# EAGLE design Thermorad-C (EAGLE 9.6.2)
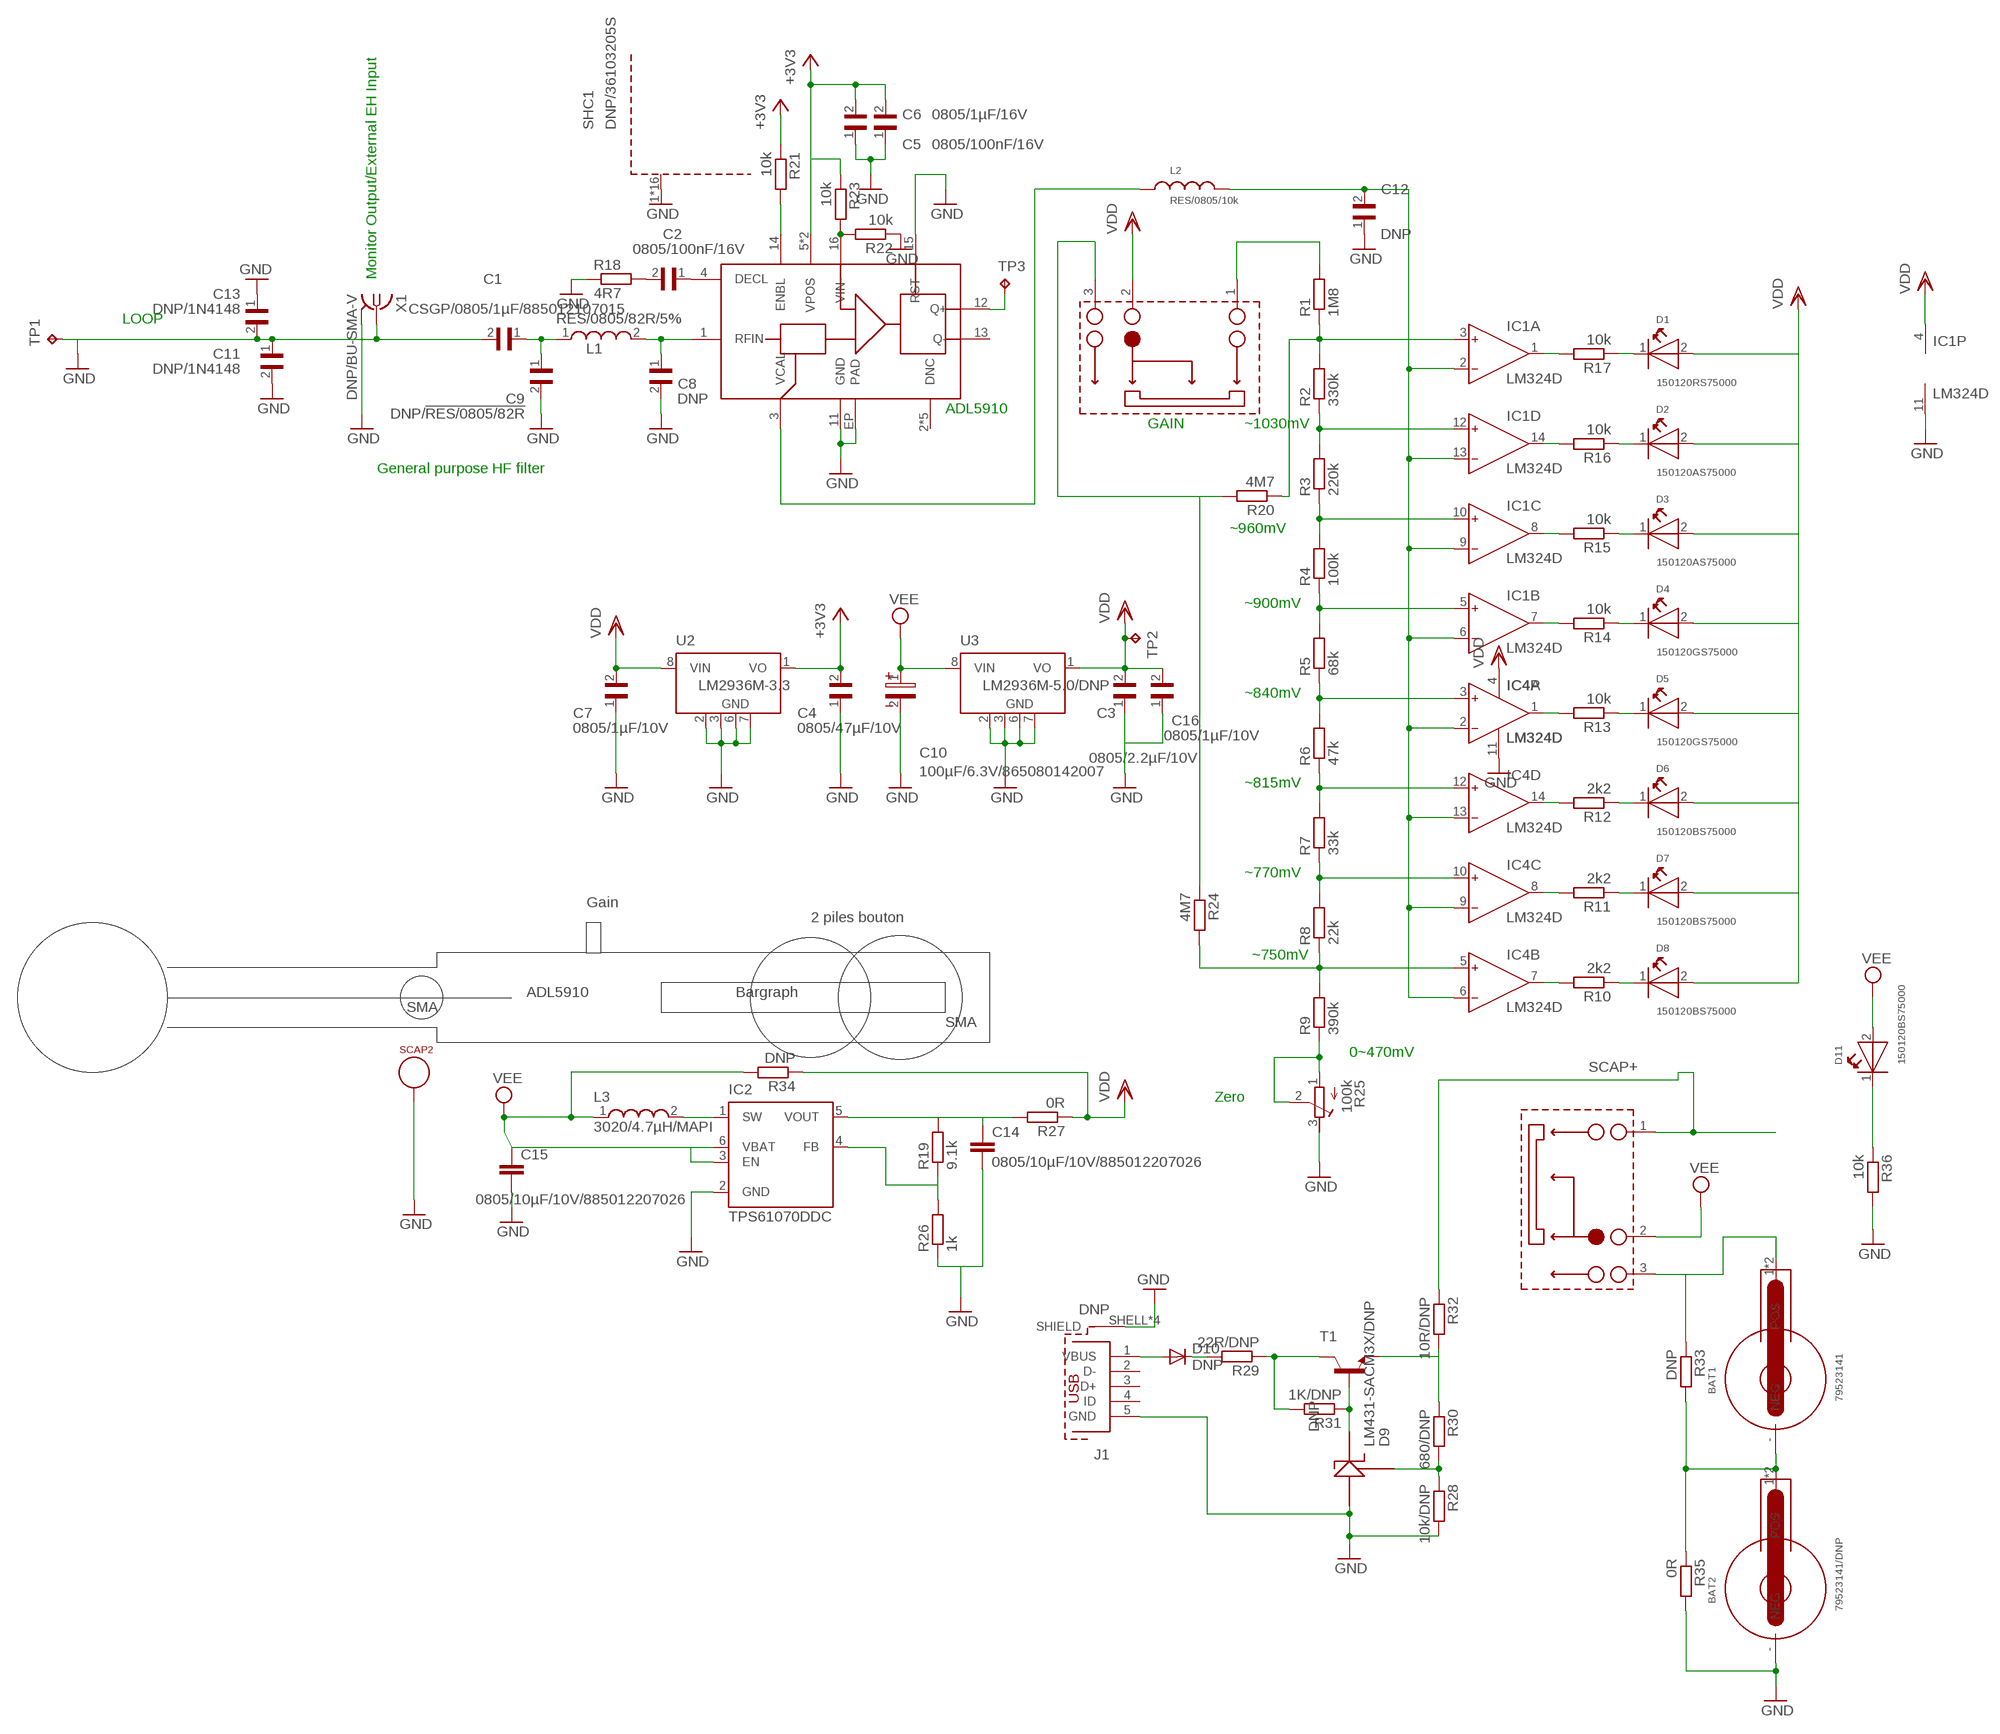
[diagram p0: schematic, sheet 1]

## Parts
BAT1  79523141  WA-BCMC_SMT_79523141  [79523141]
BAT2  79523141/DNP  WA-BCMC_SMT_79523141  [79523141]
C1  CSGP/0805/1µF/885012107015  WCAP-CSGP_0805-REFLOW  [WCAP-CSGP_0805_REFLOW]
C2  0805/100nF/16V  WCAP-CSGP_0805-REFLOW  [WCAP-CSGP_0805_REFLOW]
C3  0805/2.2µF/10V  WCAP-CSGP_0805-REFLOW  [WCAP-CSGP_0805_REFLOW]
C4  0805/47µF/10V  WCAP-CSGP_0805-REFLOW  [WCAP-CSGP_0805_REFLOW]
C5  0805/100nF/16V  WCAP-CSGP_0805-REFLOW  [WCAP-CSGP_0805_REFLOW]
C6  0805/1µF/16V  WCAP-CSGP_0805-REFLOW  [WCAP-CSGP_0805_REFLOW]
C7  0805/1µF/10V  WCAP-CSGP_0805-REFLOW  [WCAP-CSGP_0805_REFLOW]
C8  DNP  WCAP-CSGP_0805-REFLOW  [WCAP-CSGP_0805_REFLOW]
C9  DNP/!RES/0805/82R  WCAP-CSGP_0805-REFLOW  [WCAP-CSGP_0805_REFLOW]
C10  100µF/6.3V/865080142007  WCAP-ASLI_5X5.5(DXL)  [3X1.6X1.4(BXCXA)]
C11  DNP/1N4148  WCAP-CSGP_0805-REFLOW  [WCAP-CSGP_0805_REFLOW]
C12  DNP  WCAP-CSGP_0805-REFLOW  [WCAP-CSGP_0805_REFLOW]
C13  DNP/1N4148  WCAP-CSGP_0805-REFLOW  [WCAP-CSGP_0805_REFLOW]
C14  0805/10µF/10V/885012207026  C-EUC0805  [C0805]
C15  0805/10µF/10V/885012207026  C-EUC0805  [C0805]
C16  0805/1µF/10V  WCAP-CSGP_0805-REFLOW  [WCAP-CSGP_0805_REFLOW]
D1  150120RS75000  WL-SMCW-150120GS75000-G  [1206]
D2  150120AS75000  WL-SMCW-150120GS75000-G  [1206]
D3  150120AS75000  WL-SMCW-150120GS75000-G  [1206]
D4  150120GS75000  WL-SMCW-150120GS75000-G  [1206]
D5  150120GS75000  WL-SMCW-150120GS75000-G  [1206]
D6  150120BS75000  WL-SMCW-150120GS75000-G  [1206]
D7  150120BS75000  WL-SMCW-150120GS75000-G  [1206]
D8  150120BS75000  WL-SMCW-150120GS75000-G  [1206]
D9  LM431-SACM3X/DNP  LM431-SACM3X  [SOT23]
D10  DNP  DIODE-SOD123  [SOD123]
D11  150120BS75000  WL-SMCW-150120GS75000-G  [1206]
IC1  LM324D  AD8644R  [SO14]
IC2  TPS61070DDC  [TSOT23-6_DDC]
IC4  LM324D  AD8644R  [SO14]
J1  DNP  629105150521  [629105150521]
L1  RES/0805/82R/5%  WE-KI_0805A  [WE-KI_0805A]
L2  RES/0805/10k  WE-CBF_0805_74279209_WB_HS  [WE-CBF_0805(W=3.0)]
L3  3020/4.7µH/MAPI  WE-MAPI_3015/3020  [WE-MAPI_3015/3020]
R1  1M8  R-EU_M0805  [M0805]
R2  330k  R-EU_M0805  [M0805]
R3  220k  R-EU_M0805  [M0805]
R4  100k  R-EU_M0805  [M0805]
R5  68k  R-EU_M0805  [M0805]
R6  47k  R-EU_M0805  [M0805]
R7  33k  R-EU_M0805  [M0805]
R8  22k  R-EU_M0805  [M0805]
R9  390k  R-EU_M0805  [M0805]
R10  2k2  R-EU_M0805  [M0805]
R11  2k2  R-EU_M0805  [M0805]
R12  2k2  R-EU_M0805  [M0805]
R13  10k  R-EU_M0805  [M0805]
R14  10k  R-EU_M0805  [M0805]
R15  10k  R-EU_M0805  [M0805]
R16  10k  R-EU_M0805  [M0805]
R17  10k  R-EU_M0805  [M0805]
R18  4R7  R-EU_M0805  [M0805]
R19  9.1k  R-EU_R0805  [R0805]
R20  4M7  R-EU_M0805  [M0805]
R21  10k  R-EU_M0805  [M0805]
R22  10k  R-EU_M0805  [M0805]
R23  10k  R-EU_M0805  [M0805]
R24  4M7  R-EU_M0805  [M0805]
R25  100k  R-TRIMM3224X  [RTRIM3224X]
R26  1k  R-EU_R0805  [R0805]
R27  0R  R-EU_R0805  [R0805]
R28  10k/DNP  R-EU_R0805  [R0805]
R29  22R/DNP  R-EU_R0805  [R0805]
R30  680/DNP  R-EU_R0805  [R0805]
R31  1K/DNP  R-EU_R0805  [R0805]
R32  10R/DNP  R-EU_R0805  [R0805]
R33  DNP  R-EU_R0805  [R0805]
R34  DNP  R-EU_R0805  [R0805]
R35  0R  R-EU_R0805  [R0805]
R36  10k  R-EU_M0805  [M0805]
SCAP2  TESTPOINT-GROS  [TESTPOINT-GROS]
SHC1  DNP/36103205S  WE-SHC_36103205S  [WE-SHC_36103205S]
SW1  450404015514  [450404015514]
SW2  450404015514  [450404015514]
T1  DNP  BF622-NPN-SOT89-BCE  [SOT89-BCE]
TP1  TPB2,54  [B2,54]
TP2  TPB2,54  [B2,54]
TP3  TPB1,27  [B1,27]
U1  ADL5910  [LFCSP-16]
U2  LM2936M-3.3  [SO08]
U3  LM2936M-5.0/DNP  LM2936M-5.0  [SO08]
X1  DNP/BU-SMA-V  BU-SMA-V  [BU-SMA-V]

## Nets
+3V3: C4.2 C5.2 C6.2 R21.1 R23.1 U1.5(VPOS) U1.7(VPOS) U2.1(VO)
GND: BAT2.-(NEG) C1.2 C3.1 C4.1 C5.1 C6.1 C7.1 C8.2 C9.2 C10.2 C11.1 C11.2 C12.1 C13.1 C13.2 C14.2 C15.2 C16.1 D9.3(A) IC1.11(P:V-) IC2.2(GND) IC4.11(P:V-) J1.5(GND) J1.SHELL1(SHIELD) J1.SHELL2(SHIELD) J1.SHELL3(SHIELD) J1.SHELL(SHIELD) R18.1 R22.1 R25.3(A) R26.1 R28.2 R35.2 R36.2 SCAP2.1 SHC1.1(GND) SHC1.2(GND) SHC1.3(GND) SHC1.4(GND) SHC1.5(GND) SHC1.6(GND) SHC1.7(GND) SHC1.8(GND) SHC1.9(GND) SHC1.10(GND) SHC1.11(GND) SHC1.12(GND) SHC1.13(GND) SHC1.14(GND) SHC1.15(GND) SHC1.16(GND) TP1.TP U1.11(GND) U1.15(RST) U1.EP(PAD) U2.2(GND) U2.3(GND) U2.6(GND) U2.7(GND) U3.2(GND) U3.3(GND) U3.6(GND) U3.7(GND) X1.1 X1.2(GND)
N$1: IC2.1(SW) L3.2
N$2: IC4.10(C:IN+) R7.1 R8.2
N$3: IC4.12(D:IN+) R6.1 R7.2
N$4: IC4.3(A:IN+) R5.1 R6.2
N$5: IC1.5(B:IN+) R4.1 R5.2
N$6: IC1.10(C:IN+) R3.1 R4.2
N$7: IC1.12(D:IN+) R2.1 R3.2
N$8: IC1.3(A:IN+) R1.1 R2.2 R20.1
N$9: C1.1 C9.1 L1.1
N$10: IC4.14(D:OUT) R12.2
N$11: C8.1 L1.2 U1.1(RFIN)
N$12: IC1.1(A:OUT) R17.2
N$13: D1.1(K) R17.1
N$14: IC1.14(D:OUT) R16.2
N$15: D6.1(K) R12.1
N$16: IC4.8(C:OUT) R11.2
N$17: D7.1(K) R11.1
N$18: D2.1(K) R16.1
N$19: IC1.8(C:OUT) R15.2
N$21: IC4.7(B:OUT) R10.2
N$22: D8.1(K) R10.1
N$23: D3.1(K) R15.1
N$24: IC1.7(B:OUT) R14.2
N$25: D4.1(K) R14.1
N$26: IC4.1(A:OUT) R13.2
N$27: D5.1(K) R13.1
N$28: BAT1.1(POS) BAT1.2(POS) R33.1 SW2.3
N$29: BAT1.-(NEG) BAT2.1(POS) BAT2.2(POS) R33.2 R35.1
N$30: R1.2 SW1.1
N$31: C2.1 U1.4(DECL)
N$32: C2.2 R18.2
N$33: C12.2 IC1.2(A:IN-) IC1.6(B:IN-) IC1.9(C:IN-) IC1.13(D:IN-) IC4.2(A:IN-) IC4.6(B:IN-) IC4.9(C:IN-) IC4.13(D:IN-) L2.2
N$34: R9.1 R25.1(E) R25.2(S)
N$35: L2.1 U1.3(VCAL)
N$36: R21.2 U1.14(ENBL)
N$37: R20.2 R24.1 SW1.3
N$38: R22.2 R23.2 U1.16(VIN-)
N$39: R30.1 R32.2 T1.E
N$40: TP3.TP U1.12(Q+)
N$41: IC4.5(B:IN+) R8.1 R9.2 R24.2
N$42: IC2.4(FB) R19.1 R26.2
N$43: C14.1 IC2.5(VOUT) R19.2 R27.2
N$44: D11.1(K) R36.1
N$45: D10.A J1.1(VBUS)
N$46: D10.C R29.2
N$47: R29.1 R31.2 T1.C
N$48: D9.1(K) R31.1 T1.B
N$50: D9.2(REF) R28.1 R30.2
SCAP+: R32.1 SW2.1
VDD: C3.2 C7.2 C16.2 D1.2(A) D2.2(A) D3.2(A) D4.2(A) D5.2(A) D6.2(A) D7.2(A) D8.2(A) IC1.4(P:V+) IC4.4(P:V+) R27.1 R34.1 SW1.2 TP2.TP U2.8(VIN) U3.1(VO)
VEE: C10.1 C15.1 D11.2(A) IC2.3(EN) IC2.6(VBAT) L3.1 R34.2 SW2.2 U3.8(VIN)
Unconnected: J1.2(D-) J1.3(D+) J1.4(ID) U1.2(DNC) U1.6(DNC) U1.8(DNC) U1.9(DNC) U1.10(DNC) U1.13(Q-)

## Notes on the sheet
- Monitor Output/External EH Input
- LOOP
- ADL5910
- GAIN | ~1030mV
- General purpose HF filter
- ~960mV
- ~900mV
- ~840mV
- ~815mV
- ~770mV
- Gain
- 2 piles bouton
- ~750mV
- ADL5910 | Bargraph
- SMA
- SMA
- 0~470mV
- Zero

## Power pins joined to a net without a drawn wire
GND: X1.3(GND) X1.4(GND) X1.5(GND)

## Library data of the parts
BAT1 BAT2 = EAGLE-BATTERY_HOLDERS:WA-BCMC: Battery Holder WA-BCMC Characteristics Material : Phosphor Bronze Surface:Nichel Comliance:Lead free and RoHs Packaging unit is 500 <http://katalog.we-online.de/media/images/v2/Family_WA-BCMC_Battery_Holder_795xxxxx.jpg> Details see: http://katalog.we-online.de/en/em/BCMC_BATTERY_HOLDER/79523141 2015 (C) Wurth Elektronik
C1-C9 C11-C13 C16 = Eagle_Wurth_Elektronik_Passive_Capacitors_rev15a:WCAP-CSGP: WCAP-CSGP Ceramic Capacitors Characteristics Multilayer Ceramic Chip Capacitor Recommended soldering:Reflow, for 0603 and 0805 wave soldering is also allowed Operating temperature:-55 °C to +125 °C; Ceramic characteristics: Class I - NPO ; Class II -X7R, X5R High performance ceramic High capacitance stability Minimal aging Termination:Cu/Ni/Sn <http://katalog.we-online.de/media/images/eisos/WCAP-CSGP_pf2.jpg> Details see: http://katalog.we-online.de/en/pbs/WCAP-CSGP/?m Created: 2015-01-28 2015 (C) Wurth Elektronik
C10 = Eagle_Wurth_Elektronik_Passive_Capacitors_rev15a:WCAP-ASLI: WCAP-ASLI Aluminum Electrolytic Capacitors Characteristics Aluminum Electrolytic Capacitor Recommended soldering: Reflow Operating temperature: -55 °C to +105 °C Low impedance product series Load life:2000 h @ +105 °C Package name and Variant abbreviation: Package: Package: B X C X A = length of the solder pad X width of the solder pad X pitch of the solder pad. Variant: D X L = Diameter of the body part X Height of the body part. <http://katalog.we-online.de/media/images/eisos/WCAP-ASLI_pf2.jpg> Details see: http://katalog.we-online.de/en/pbs/WCAP-ASLI?m Created: 2015-03-10 2015 (C) Wurth Elektronik
C14 C15 = resistor:C-EU: CAPACITOR, European symbol
D1-D8 D11 = Wurth_Elektronik_Optoelectronics_rev15b:WL-SMCW: SMD mono-color Chip LED Characteristics Low energy consumption High reliability Low current requirement Fast switching No UV/IR radiation Smallest SMD package with exceptional brightness Top view Wide viewing angle PBC high-usage Applications Backlight for mobile and portable device keypads Indoor and outdoor message boards Flat backlight for LCDs, switches and symbols Display for industrial control systems and traffic Miniaturized color effects Pedestrian mark Optical indicators General lighting Toys <http://katalog.we-online.de/media/images/eipal/WL-SMCW_pf2.jpg> Details see: http://katalog.we-online.de/en/led/WL-SMCW?m Updated 2015-04-10 2015 (C) Wurth Elektronik; COMPANY-URL: http://www.we-online.de; CREATED-BY: Christin Otto; CREATED-DATE: APR 2013; DATASHEET-URL: http://katalog.we-online.de/en/led/WL-SMCW?m=t&sq=smcw&sp=&sp=http%3A%2F%2Fwww.we-online.de%2Fweb%2Fen%2Felectronic_components%2Fsearchpage_PBS.php%3Fsearch%3Dsmcw#vs_t2:2; MANUFACTURER: Würth Elektronik eiSos GmbH
D9 = Ebenoid-Actifs:LM431-SACM3X
D10 = diode:DIODE-: DIODE
IC1 IC4 = analog-devices:AD8644: Single and Quad 18 V Operational Amplifiers Source: http://www.analog.com/static/imported-files/data_sheets/AD8614_8644.pdf; MF: ALTERA CORPORATION; MPN: AD8644ARZ; OC_FARNELL: 1438873; OC_NEWARK: 59K7037
IC2 = texas:TPS6107*: 90% EFFICIENT SYNCHRONOUS BOOST CONVERTER WITH 600-mA SWITCH Source: http://focus.ti.com/lit/ds/symlink/tps61070.pdf; MPN: TPS61070DDCR; OC_FARNELL: 1461062; OC_NEWARK: 64M3125
J1 = InputOutputIO (rev18a):629105150521: WR-COM_USB_Micro Type B_Horizontal_SMT ; Micro Type B Horizontal SMT - 3A current at Pin1 & Pin 5 - with Pegs and THT shielding Pins - T&R Packaging Code : Con_I-O_COM_USB_2.0_B_629105150521_629105150521 <http://katalog.we-online.de/media/images/eican/Con_I-O_COM_USB_2.0_B_629105150521_pf2.jpg> Details see: http://katalog.we-online.de/em/datasheet/629105150521.pdf Created 12/08/2014, Dan Xu 2014 (C) Wurth Elektronik
L1 = EAGLE-EMC_COMPONENTS-rev17a:WE-KI: SMD Wire Wound Ceramic Inductor Characteristics WE-KI series offers you an excellent Q factor and highest possible self resonant frequencies up to 12.5 GHz Inductance tolerances: 5% (2% on request) High thermal stability Operating temperature: –40°C to +125°C Applications Especially developed for high frequency applications RF transceiver/communications Bluetooth Wireless LAN <http://katalog.we-online.de/media/images/v2/Family_WE-KI.jpg> Details see: http://katalog.we-online.de/en/pbs/WE-KI Updated by Dan Xu 2014-07-08 2014 (C) Wurth Elektronik
L2 = EMCComponents (rev19a):WE-CBF_0805: WE-CBF SMD EMI Suppression Ferrite Bead Characteristics Reliable Ni-Sn electrodes High rated current up to 6 A Operating temperature: –55 ºC to +125 ºC Applications Perfect as data lined filter and for uncoupling of distribution voltage Variant abbreviation WB means WIDE BAND HS means HIGH SPEED HC means HIGH CURRENT <http://katalog.we-online.de/media/images/v2/Family_WE-CBF.jpg> Details see: http://katalog.we-online.de/en/pbs/WE-CBF Updated on 2014-06-19 2014 (C) Wurth Elektronik; WE-NUMBER: 74279209/1200Ω(Z@100MHz)
L3 = Wurth_Elektronik_Passive_rev15b:WE-MAPI: SMD Metal Alloy Power Inductor Characteristics Magnetic iron alloy allows high rated currents Compact design Magnetically shielded High current capability and handles high transient current spikes Low acoustic noise and low leakage flux noise Operating temperature: –40 °C to 125 °C Applications DC/DC-converter for high current power supplies DC/DC-converter for Field Programmable Gate Array (FPGA) POL-converters Portable power like PDA, digital camera Mainboards/graphic cards Battery powered devices Wireless communication devices Power supplies for smartphones, tablet PCs and other mobile devices <http://katalog.we-online.de/media/images/eisos/IndMAPI_pf2.jpg> Details see: http://katalog.we-online.de/en/pbs/WE-MAPI? Updated by Dan Xu 2014-07-08 2014 (C) Wurth Elektronik
R1-R24 R26-R36 = resistor:R-EU_: RESISTOR, European symbol
R25 = resistor:R-TRIMM: Trimm resistor
SCAP2 = Ebenoid-Divers:TESTPOINT-GROS
SHC1 = EMCComponents (rev19a):WE-SHC: Shielding Cabinet Characteristics Tin plate in accordance with DIN EN 10202/10203 Shielding effectiveness up to 55 dB Two-part case consisting of a solderable grid frame (SMD/THT) and a removable cover Applications To prevent EMI radiation from PCB and to keep sensitivity low of: - RF output stages - RF input and amplifier stages; - Oscillators - EMC sensitive parts in plastic cases <http://katalog.we-online.de/media/images/v2/Family_WE-SHC_NEU_2017.jpg> Details see: http://katalog.we-online.de/en/pbs/WE-SHC?m Updated by Dan Xu 2014-07-11 2014 (C) Wurth Elektronik
SW1 SW2 = EAGLE-450404015514-rev1:450404015514: WS-SLSU Right angle Slide Switch with boss design Specification Rating 300mA, 12VDC Contact Resistance Initial:70mΩ max. After life test: 200mΩ max. Insulation Resistance: min.100MΩ at 500VDC Dielectric Strength : 250VAC for 1 minute Travel:1.5±0.15mm Operating force :150 ± 75g. Life cycle:10000 steps Switch function : ON-ON. Material Cover : : Stainless Steel Base :PA46 UL 94 HB,COLOR Black Frame :LCP UL 94 V-0, color Black Contact : :Copper Alloy with Silver Terminal : Copper Alloy with Silver 2015 (C) Wurth Elektronik
T1 = transistor-neu-to92:*-NPN-: NPN Transistror
TP1-TP3 = testpad:TP: Test pad
U1 = LT:ADL5910
U2 = national-semiconductor:LM2936M?*: Ultra-Low Quiescent Current LDO Voltage Regulator Source: Data sheet <http://www.national.com/ds/LM/LM2936.pdf>; MF: NATIONAL SEMICONDUCTOR; MPN: LM2936M-3.3/NOPB; OC_FARNELL: 1469059; OC_NEWARK: 41K4514
U3 = national-semiconductor:LM2936M?*: Ultra-Low Quiescent Current LDO Voltage Regulator Source: Data sheet <http://www.national.com/ds/LM/LM2936.pdf>; MF: NATIONAL SEMICONDUCTOR; MPN: LM2936M-5.0/NOPB; OC_FARNELL: 9494421; OC_NEWARK: 41K4515
X1 = con-coax:BU-SMA-V: FEMALE SMA CONNECTOR Radiall distributor RS 112-3794; OC_FARNELL: unknown; OC_NEWARK: unknown

## Board
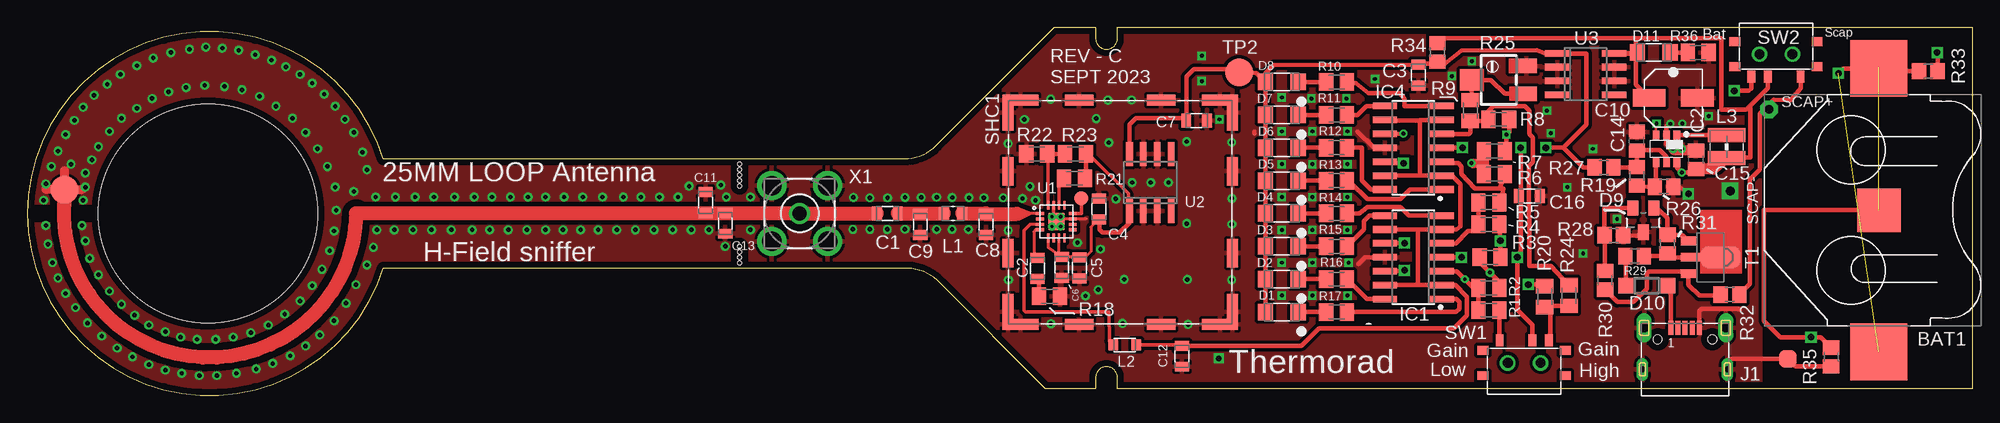
[diagram p1: board, top side]
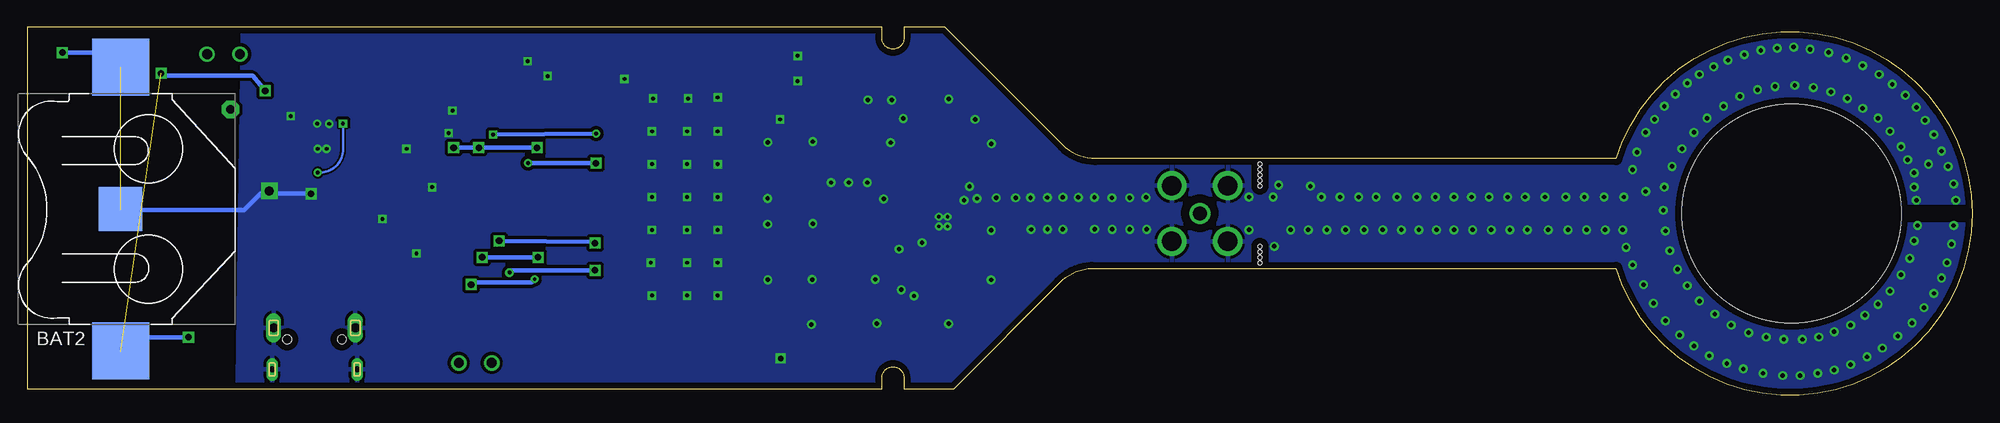
[diagram p2: board, bottom side, seen from below]

Size 177.49 x 33.61 mm. Coordinates in mm from the lower left corner, seen from the top.
Outline: 32.49,21.61 arc325 32.49,11.61 80.34,11.61 arc-45 83.28,10.27 92.94,0.61 97.49,0.61 97.49,1.61 arc-180 99.49,1.61 99.49,0.61 177.49,0.61 177.49,33.61 99.49,33.61 99.49,32.61 arc-180 97.49,32.61 97.49,33.61 93.74,33.61 82.95,22.82 arc-45 80.02,21.61 32.49,21.61
Copper layers (1*16): Top 0.035mm / dielectric 1.5mm / Bottom 0.035mm
Design rules "default *": minimum track width 0.2mm, minimum drill 0.3mm, track to track 0.15mm, track to pad 0.15mm, pad to pad 0.15mm, via to via 0.15mm, smd to smd 0.15mm, copper to edge 0.6mm, drill to drill 8mil, minimum pad ring 10mil, minimum via ring 8mil, stop-mask expansion 4mil, vias tented up to drill 0mil, thermal gap 10mil
Holes 20 mm at 16.49,16.61
Holes 0.35 mm at 64.99,12.11 64.99,12.61 64.99,13.11 64.99,13.61 64.99,19.11 64.99,19.61 64.99,20.11 64.99,20.61 64.99,21.11
tRestrict: area 69.3,15.4 to 71.7,17.8; 11 lines
bRestrict: area 69.3,15.4 to 71.7,17.8; 1 lines

### Footprints (pad centres in the part's own frame; a part is rotated, then mirrored left to right if it is on the bottom)
79523141 = smd 5.2 x 5.2: 1 -12.95,0; 2 12.95,0 | smd 4 x 4: - 0,0
WCAP-CSGP_0805_REFLOW = smd 0.9 x 1.3: 1 -0.95,0; 2 0.95,0
3X1.6X1.4(BXCXA) = smd 3 x 1.6: 1 2.2,0; 2 -2.2,0
C0805 = smd 1.3 x 1.5: 1 -0.85,0; 2 0.85,0
1206 = smd 1.4 x 1.5: 1 -1.5,0; 2 1.5,0
SOT23 = smd 1 x 1.4: 1 -0.95,-1.1; 2 0.95,-1.1; 3 0,1.1
SOD123 = smd 1.4 x 1.4: A 1.9,0; C -1.9,0
SO14 = smd 0.6 x 2.2: 1 -3.81,-2.6; 2 -2.54,-2.6; 3 -1.27,-2.6; 4 0,-2.6; 5 1.27,-2.6; 6 2.54,-2.6; 7 3.81,-2.6; 8 3.81,2.6; 9 2.54,2.6; 10 1.27,2.6; 11 0,2.6; 12 -1.27,2.6; 13 -2.54,2.6; 14 -3.81,2.6
TSOT23-6_DDC = smd 0.6 x 0.8: 1 -0.95,-1.25; 2 0,-1.25; 3 0.95,-1.25; 4 0.95,1.25; 5 0,1.25; 6 -0.95,1.25
629105150521 = smd 0.45 x 1.3: 1 -1.3,1.05; 2 -0.65,1.05; 3 0,1.05; 4 0.65,1.05; 5 1.3,1.05 | drill 0.85 pad 1.2 long: SHELL -3.725,1.05; SHELL1 3.725,1.05 | drill 0.55 pad 0.9 long: SHELL2 -3.875,-2.75; SHELL3 3.875,-2.75 | hole 0.8: -2.5,0; 2.5,0
WE-KI_0805A = smd 0.925 x 1.2: 1 -0.838,0; 2 0.838,0
WE-CBF_0805(W=3.0) = smd 0.9 x 1: 1 -1.05,0; 2 1.05,0
WE-MAPI_3015/3020 = smd 1.3 x 3.4: 1 -1.05,0; 2 1.05,0
M0805 = smd 1.3 x 1.6: 1 -0.95,0; 2 0.95,0
R0805 = smd 1.3 x 1.5: 1 -0.85,0; 2 0.85,0
RTRIM3224X = smd 1.32 x 1.9: 1 -1.27,-2.54; 3 1.27,-2.54 | smd 2 x 2: 2 0,2.54
TESTPOINT-GROS = smd 1.6 x 1.6: 1 0,0
WE-SHC_36103205S = smd 2.6 x 1: 1 -3.75,10.25; 2 3.75,10.25; 7 -3.75,-10.25; 8 3.75,-10.25 | smd 1 x 2.6: 3 -10.25,3.75; 4 -10.25,-3.75; 5 10.25,-3.75; 6 10.25,3.75 | smd 3.3 x 1: 9 -9.1,10.25; 11 9.1,10.25; 13 -9.1,-10.25; 15 9.1,-10.25 | smd 1 x 3.3: 10 -10.25,9.1; 12 10.25,9.1; 14 -10.25,-9.1; 16 10.25,-9.1
450404015514 = smd 0.7 x 1.1: 1 2.25,-2.05; 2 -0.75,-2.05; 3 -2.25,-2.05 | smd 1 x 0.8: Z1 -3.75,1.15; Z2 3.75,1.15; Z3 3.75,-1.15; Z4 -3.75,-1.15 | drill 0.9: Z5 -1.5,0; Z6 1.5,0
SOT89-BCE = smd 0.8 x 1.4: B -1.499,-1.981; E 1.499,-1.981 | smd 0.8 x 1.9: C 0,-1.727 | smd 2.032 x 3.65: C@1 0,0.94
B2,54 = smd 2.54 x 2.54: TP 0,0
B1,27 = smd 1.27 x 1.27: TP 0,0
LFCSP-16 = smd 0.8 x 0.305: 1 -1.5,0.75; 2 -1.5,0.25; 3 -1.5,-0.25; 4 -1.5,-0.75; 9 1.5,-0.75; 10 1.5,-0.25; 11 1.5,0.25; 12 1.5,0.75 | smd 0.305 x 0.8: 5 -0.75,-1.5; 6 -0.25,-1.5; 7 0.25,-1.5; 8 0.75,-1.5; 13 0.75,1.5; 14 0.25,1.5; 15 -0.25,1.5; 16 -0.75,1.5 | smd 1.5 x 1.6: EP 0,0
SO08 = smd 0.6 x 2.2: 1 -1.905,-2.6; 2 -0.635,-2.6; 3 0.635,-2.6; 4 1.905,-2.6; 5 1.905,2.6; 6 0.635,2.6; 7 -0.635,2.6; 8 -1.905,2.6
BU-SMA-V = drill 1.27: 1 0,0 | drill 1.778: 2 -2.55,2.55; 3 2.55,2.55; 4 2.55,-2.55; 5 -2.55,-2.55

### Placement (x,y rotation side)
BAT1  168.99,16.91 270 top
BAT2  168.99,17.01 90 bottom
C1  78.49,16.61 180 top
C2  92.2,11.58 270 top
C3  126.96,29.24 90 top
C4  97.8,17.02 270 top
C5  96.02,11.64 90 top
C6  94.4,11.68 90 top
C7  106.72,25.1 180 top
C8  87.49,15.61 270 top
C9  81.49,15.61 270 top
C10  150.21,27.16 180 top
C11  61.89,17.61 90 top
C12  105.37,3.57 90 top
C13  63.69,15.71 90 top
C14  146.89,23.21 90 top
C15  152.29,21.51 90 top
C16  137.09,18.21 180 top
D1  114.49,7.61 180 top
D2  114.49,10.61 180 top
D3  114.49,13.61 180 top
D4  114.49,16.61 180 top
D5  114.49,19.61 180 top
D6  114.49,22.61 180 top
D7  114.49,25.61 180 top
D8  114.49,28.61 180 top
D9  147.49,16.01 180 top
D10  147.79,10.01 0 top
D11  148.44,31.3 180 top
IC1  126.49,12.61 90 top
IC2  149.59,22.51 180 top
IC4  126.49,22.61 90 top
J1  151.29,5.11 0 top
L1  84.49,16.61 0 top
L2  100.15,4.59 0 top
L3  155.09,22.71 90 top
R1  133.39,7.78 0 top
R2  133.39,9.81 180 top
R3  133.49,12.61 180 top
R4  133.39,15.61 0 top
R5  133.39,17.61 180 top
R6  133.89,20.21 0 top
R7  133.89,22.31 180 top
R8  134.29,25.21 0 top
R9  131.69,26.01 270 top
R10  119.49,28.61 0 top
R11  119.49,25.61 0 top
R12  119.49,22.61 0 top
R13  119.49,19.61 0 top
R14  119.49,16.61 0 top
R15  119.49,13.61 0 top
R16  119.49,10.61 0 top
R17  119.49,7.61 0 top
R18  93.29,9.05 180 top
R19  146.89,20.01 90 top
R20  138.49,9.01 270 top
R21  95.57,19.82 180 top
R22  92.12,22.04 0 top
R23  95.66,22.04 180 top
R24  140.69,9.11 90 top
R25  134.29,28.81 90 top
R26  149.37,19.06 180 top
R27  143.89,20.81 0 top
R28  144.79,14.61 0 top
R29  146.69,12.71 180 top
R30  143.99,10.51 90 top
R31  149.69,13.81 270 top
R32  155.39,9.21 180 top
R33  173.49,29.61 0 top
R34  128.69,31.32 90 top
R35  164.63,3.5 270 top
R36  152.49,31.31 0 top
SCAP2  160.69,3.31 0 top
SHC1  99.73,16.73 270 top
SW1  136.61,2.96 180 top
SW2  159.59,31.16 0 top
T1  153.59,12.61 270 top
TP1  3.4,18.77 0 top
TP2  110.59,29.51 270 top
TP3  96.19,18.01 0 top
U1  93.91,15.86 0 top
U2  102.49,19.44 0 top
U3  142.22,29.34 270 top
X1  70.49,16.61 0 top

### Tracks (layer width: path | path; a pad name or v marks a point on that pad's centre or on a via)
+3V3
  Top 0.2: 96.86,22.04 R23.1 | 96.61,19.91 R21.1
  Top 0.254: U1.5 93.16,13.5 C6.2 94.14,12.65 94.31,12.62 | 94.31,12.62 arc-90 94.16,12.77 U1.7 | 94.31,12.62 95.26,12.62 arc-90 C5.2 95.36,12.62 96.56,12.62 97.06,13.12 97.06,15.37 97.81,16.12 97.84,16.15
  Top 0.305: U2.1 100.49,16.93 100.49,18.41 96.86,22.04
  Top 0.406: 97.81,16.12 C4.2 97.84,16.03 97.84,15.14 98.12,14.86 99.69,14.86 100.58,15.75 U2.1 | R23.1 96.61,19.91
GND  (via drill 0.3 pad 0.41, 0.35, 0.4 pad 0.41, 0.5, 0.6, 0.8 pad 1.5)
  Top 0.254: 94.16,16.11 U1.11 96.66,16.11 | 94.16,16.11 arc90 U1.EP | 94.16,16.11 94.16,16.16 v94.3,16.3
  Top 0.305: U1.15 93.66,16.3 v93.52,16.3 | C11.1 C13.2 63.74,16.66 63.79,16.61
  Top 0.406: X1.1 arc279 70.53,16.61 | 3.49,18.61 3.4,18.61 TP1.TP 3.4,18.8 3.39,18.81 | IC1.11 122.09,12.61 121.49,12.01 | IC4.11 122.89,22.61 121.39,24.11 | 111.99,24.11 111.99,23.91 | D9.3 146.84,14.56 R28.2 | 150.25,22.41 149.59,22.91 IC2.2 149.57,24.61 | 151.79,22.41 152.39,22.31 C15.2 | C14.2 146.89,24.61 | R26.1 150.79,19.01 v151.59,18.41 | J1.SHELL3 155.31,3.31 SCAP2.1 161.35,2.65 R35.2 | J1.5 152.59,7.71 152.79,7.91 156.19,7.91 156.29,7.81
  Top 0.8: 3.39,18.81 4.99,18.81 | 3.39,18.81 3.39,20.51 | 3.39,18.81 1.69,18.81
  Top 0.9: 150.25,22.41 151.79,22.41
  Top 1.27: 3.49,18.61 arc96 16.04,3.46 arc92 29.99,16.61 63.79,16.61 70.53,16.61 C1.2
  Bottom 0.406: 151.59,18.71 v151.59,18.41 156.19,18.41 157.69,16.91 168.89,16.91 BAT2.-
  other vias: 108.74,3.36 1.69,15.51 1.89,13.81 2.29,12.11 2.79,10.71 3.49,9.31 4.39,8.01 5.49,6.61 6.79,5.41 8.19,4.31 9.59,3.51 11.09,2.81 12.59,2.31 14.09,2.01 15.69,1.81 17.29,1.81 19.09,2.01 20.89,2.41 22.39,2.91 23.99,3.61 25.39,4.51 26.69,5.51 4.99,15.51 5.29,14.11 5.69,12.51 6.49,11.01 7.49,9.51 8.59,8.31 9.79,7.31 11.09,6.41 12.59,5.81 13.99,5.31 15.49,5.11 17.19,5.11 18.79,5.31 20.39,5.71 21.99,6.41 23.49,7.41 24.89,8.61 27.99,6.81 25.99,10.01 29.09,8.41 26.89,11.51 29.99,10.11 27.59,13.21 27.99,15.01 28.19,16.91 28.09,19.01 30.99,11.91 31.59,13.51 31.89,15.11 5.09,17.81 5.29,19.01 5.29,20.31 3.99,21.11 2.19,20.91 1.49,17.81 1.69,19.31 29.79,18.61 31.79,18.11 30.99,20.61 27.39,20.91 26.49,22.51 30.59,22.21 25.39,24.01 24.19,25.31 22.69,26.41 21.19,27.31 19.59,27.91 17.99,28.21 16.19,28.31 14.49,28.11 12.89,27.71 11.39,27.11 9.99,26.21 8.59,25.31 7.49,24.11 6.49,22.71 5.89,21.51 2.79,22.31 3.49,23.81 4.29,25.11 5.09,26.31 6.09,27.41 7.29,28.41 8.49,29.31 9.99,30.11 11.49,30.81 13.09,31.31 14.79,31.61 16.29,31.81 17.79,31.71 19.29,31.51 20.79,31.11 22.29,30.61 23.59,30.01 24.89,29.31 25.99,28.51 27.09,27.51 28.09,26.41 28.99,25.21 29.79,24.01 33.49,15.11 35.19,15.11 36.89,15.11 38.69,15.11 40.59,15.11 42.19,15.11 43.89,15.11 45.59,15.11 47.29,15.11 42.39,18.11 33.59,18.11 35.39,18.11 37.09,18.11 38.99,18.11 40.79,18.11 44.09,18.11 48.89,15.11 50.49,15.11 52.09,15.11 53.79,15.11 55.49,15.11 57.19,15.11 58.89,15.11 60.59,15.11 62.19,15.11 63.69,13.61 65.99,15.11 45.69,18.11 47.29,18.11 48.99,18.11 50.69,18.11 52.49,18.11 54.39,18.11 55.99,18.11 57.69,18.11 59.39,18.11 60.39,19.11 63.29,19.21 63.79,18.11 65.99,18.11 75.39,18.08 76.89,18.04 78.5,18.05 80.1,18.08 81.57,18.08 82.99,18.09 84.4,18.07 85.94,18.06 87.3,18.05 89.07,18.05 90.82,17.98 92.01,17.82 75.33,15.16 76.89,15.16 78.48,15.16 82.99,15.16 84.39,15.16 85.89,15.15 89.52,15.07 80.09,15.17 93.52,15.42 94.3,15.42 89.51,22.98 91,25.21 93.4,27.06 98.61,26.97 100.78,26.98 109.91,23.11 109.94,17.99 105.93,6.47 109.92,10.55 105.87,10.57 89.54,10.54 93.41,6.53 109.93,15.63 99.96,6.56 96.57,9.08 97.74,9.64 97.94,13.34 100.84,19.44 102.54,19.44 104.14,19.44 97.55,25.29 98.71,23.08 91.51,19.08 100.11,10.58 105.81,15.68 105.81,23.18 99.34,17.94 95.84,13.94 150.19,22.51 150.99,22.51 145.09,16.11 138.69,26.01 142.89,22.51 117.19,27.11 120.39,27.11 120.49,24.11 117.29,24.11 114.49,24.11 114.49,27.21 114.49,21.11 117.29,21.11 120.49,21.11 114.49,18.11 117.29,18.11 120.49,18.11 114.49,15.11 117.29,15.11 120.49,15.11 114.49,12.11 117.29,12.11 120.59,12.11 114.49,9.11 117.29,9.11 120.49,9.11 107.19,31.01 107.19,28.71 108.79,25.21 155.41,18.67 149.95,24.79 151.04,24.82 140.54,19.01 141.98,12.95 123,28.89 130,29.16 131.83,30.53 139.05,23.96 153.46,25.49
  pour Top (isolate 0.3, rank 6): 111.97,24.47 112.49,24.61 113.49,24.11 113.49,31.36 158.07,31.96 158.17,1.18 112.07,1.08
  pour Top (isolate 0.3): -0.51,36.61 -0.51,-0.39 127.62,1.4 127.64,36.61
  pour Bottom (isolate 0.3): -0.51,36.61 -0.51,-0.39 158.29,1.21 157.79,35.71 109.49,36.61
  pour Bottom: 148.09,24.81 151.69,24.81 151.69,18.11 148.09,18.11
N$1
  Top 0.406: L3.2 IC2.1
N$2  (via drill 0.35)
  Top 0.406: IC4.10 v125.59,23.91 | R7.1 134.89,22.31 134.99,22.41 v134.99,23.81 135.24,24.06 R8.2
  Bottom 0.406: v125.59,23.91 v134.99,23.81
N$3  (via drill 0.35, 0.6)
  Top 0.406: 132.94,20.76 R6.1 | R7.2 132.99,21.71 | 132.99,20.71 132.94,20.76 | 132.94,20.76 132.94,21.16 | 131.94,21.16 v131.8,21.21 | v125.59,21.21 124.02,21.21 IC4.12
  Top 0.813: 132.99,21.71 132.99,20.71 | 132.94,21.16 131.94,21.16
  Bottom 0.406: v131.8,21.21 v125.59,21.21
N$4
  Top 0.406: IC4.3 129.22,21.21 130.59,21.21 130.89,20.91 130.89,20.21 132.09,18.91 134.69,18.91 | 134.69,18.91 134.44,19.06 R6.2 | R5.1 134.49,17.66 134.69,18.91
N$5
  Top 0.406: R5.2 R4.1 131.94,15.01 131.49,15.01 130.36,13.88 IC1.5
N$6  (via drill 0.6)
  Top 0.406: R3.1 v134.44,14.11 R4.2 | IC1.10 123.92,13.91 v125.69,13.91
  Bottom 0.406: v125.69,13.91 125.79,13.91 125.79,14.01 v134.44,14.11
N$7  (via drill 0.35, 0.6)
  Top 0.406: IC1.12 125.69,11.34 v125.69,11.41 | R2.1 134.34,10.36 v133.49,11.21 132.54,12.16 R3.2
  Bottom 0.406: v125.69,11.41 133.29,11.41 v133.49,11.21 133.34,11.41
N$8  (via drill 0.3, 0.6)
  Top 0.406: R1.1 R2.2 131.99,9.81 v131.19,10.6 130.49,11.31 129.12,11.31 IC1.3 | R20.1 138.34,10.11 v136.99,10.11
  Bottom 0.406: v136.99,10.11 136.79,10.31 131.49,10.31 v131.19,10.6
N$9
  Top 0.254: C1.1 arc90 79.49,16.56 C9.1
  Top 1.27: C1.1 L1.1
N$10
  Top 0.406: R12.2 121.79,22.61 121.79,19.61 122.6,18.8 IC4.14
N$11
  Top 0.254: U1.1 91.31,16.62
  Top 0.4: 91.31,16.62 90.31,16.62
  Top 0.406: 90.31,16.57 90.31,16.62
  Top 1.27: L1.2 87.49,16.61 C8.1 90.31,16.57
N$12
  Top 0.406: R17.2 130.39,7.61 130.69,7.91 130.69,8.51 130.4,8.8 IC1.1
N$13
  Top 0.406: R17.1 D1.1
N$14
  Top 0.406: R16.2 122.25,8.8 IC1.14
N$15
  Top 0.406: D6.1 R12.1
N$16
  Top 0.406: IC4.8 122.2,26.42 121.39,25.61 R11.2
N$17
  Top 0.406: R11.1 D7.1
N$18
  Top 0.406: D2.1 R16.1
N$19
  Top 0.406: R15.2 121.99,15.16 121.99,15.91 122.5,16.42 IC1.8
N$20
  Top 0.3: 90.51,17.02 91.51,16.62 90.51,16.12
N$21
  Top 0.406: IC4.7 125.68,26.42 125.68,27.11 125.26,27.6 122.38,27.6 121.26,28.52 120.72,28.51 120.49,28.51 R10.2
N$22
  Top 0.406: R10.1 D8.1
N$23
  Top 0.406: D3.1 R15.1
N$24
  Top 0.406: R14.2 121.59,16.61 122.29,17.21 125.29,17.21 126.09,16.41 IC1.7
N$25
  Top 0.406: R14.1 D4.1
N$26
  Top 0.406: R13.2 120.79,19.41 122.24,17.96 122.34,17.91 125.29,17.91 126.19,18.81 IC4.1
N$27
  Top 0.406: R13.1 D5.1
N$28  (via drill 0.6)  (1 unrouted)
  Top 0.406: 169.17,29.84 BAT1.1 168.74,30.11 | 157.39,29.01 SW2.3 157.34,28.03 157.13,27.81 v155.79,27.81 | v165.29,29.41 165.72,29.84 169.17,29.84 | R33.1 170.49,29.61 170.29,29.41 169.61,29.41 169.17,29.84
  Bottom 0.406: v155.79,27.81 156.94,29.19 165.29,29.21 v165.29,29.41
N$29  (via drill 0.6)  (1 unrouted)
  Top 0.406: BAT1.- 158.49,16.91 158.49,6.81 159.99,5.31 v162.79,5.31 163.67,5.31 R35.1 | v174.29,31.31 174.34,31.26 R33.2
  Bottom 0.406: BAT2.2 169.04,30.01 169.09,30.61 169.09,31.31 v174.29,31.31 | v162.79,5.31 167.89,5.31 168.99,4.21 BAT2.1
N$30
  Top 0.406: SW1.1 134.34,5.63 R1.2
N$31
  Top 0.254: U1.4 92,15.11 91.87,14.95 91.86,12.65 C2.1
N$32
  Top 0.2: C2.2 92.34,10.49
  Top 0.406: 92.34,10.49 R18.2
N$33
  Top 0.254: 105.3,4.49 C12.2
  Top 0.305: L2.2 105.39,4.59 105.39,4.41 105.3,4.49
  Top 0.406: C12.2 116.3,4.52 117.89,6.11 130.19,6.11 131.39,7.31 131.39,9.01 130.33,10.07 IC1.2 IC1.13 126.89,10.07 126.89,15.15 | IC1.9 126.89,15.15 | 126.89,15.15 IC1.6 130.43,15.15 130.79,15.41 130.79,19.31 130.03,20.07 IC4.2 IC4.13 127.09,20.07 127.09,25.11 | 127.09,25.11 123.89,25.11 IC4.9 | IC4.6 127.09,25.15 127.09,25.11
N$34
  Top 0.406: R9.1 131.85,27.32 R25.2 133.59,28.81 134.86,27.54 R25.1
N$35
  Top 0.254: U1.3 91.53,15.61
  Top 0.305: 91.53,15.61 90.98,15.06 90.98,7.75 91.09,7.64 98.73,7.63 98.74,4.95 L2.1
N$36
  Top 0.2: 94.16,18.95 94.16,19.36 R21.2
  Top 0.305: 94.16,19.13 94.16,18.95 U1.14
N$37
  Top 0.406: SW1.3 138.99,5.74 138.99,7.81 138.74,8.06 R20.2 138.59,8.16 R24.1
N$38
  Top 0.2: R22.2 93.16,21.95 93.16,21.35
  Top 0.305: 93.16,21.35 U1.16
  Top 0.406: R22.2 R23.2
N$39
  Top 0.406: R30.1 143.99,9.61 145.09,8.51 146.59,8.51 147.79,9.71 147.79,11.11 147.99,11.31 151.41,11.31 T1.E 151.6,10.09 152.59,9.11 154.44,9.11 R32.2
N$40
  Top 0.305: U1.12 96.19,16.61 TP3.TP
N$41
  Top 0.2: R8.1 133.34,25.96
  Top 0.406: IC4.5 131.56,23.88 131.69,24.01 R9.2 133.19,25.06 R8.1 | R24.2 139.04,11.81 137.09,11.81 137.06,20.96 137.39,21.29 137.39,23.55 137.09,23.85 137.09,26.01 136.69,26.41 133.79,26.41 133.34,25.96
N$42
  Top 0.406: R19.1 147.04,19.01 R26.2 148.64,19.21 IC2.4
N$43
  Top 0.406: IC2.5 149.59,21.81 148.99,22.41 147.04,22.41 C14.1 R19.2 146.84,20.81 R27.2
N$44
  Top 0.406: D11.1 R36.1
N$45
  Top 0.406: J1.1 149.99,9.21 D10.A
N$46
  Top 0.406: D10.C 145.89,12.66 R29.2
N$47
  Top 0.406: R29.1 149.44,12.71 R31.2 150.04,12.61 T1.C
N$48
  Top 0.406: T1.B 151.05,14.66 R31.1 149.69,16.21 148.89,16.91 D9.1
N$50
  Top 0.406: D9.2 146.54,16.96 146.39,17.11 143.94,17.11 R28.1 143.99,14.01 R30.2
SCAP+  (via drill 0.8 pad 1.6)
  Top 0.406: SW2.1 161.87,28.07 160.94,26.98 159.4,26.99 | R32.1 157.19,10.16 157.19,19.71 158.1,20.63 158.1,25.53 | 158.1,25.53 158.1,25.73 159.4,26.99 | 159.4,26.99 159.39,27.01 | v158.96,26.11 158.1,25.73 158.1,25.53
VDD  (via drill 0.6)
  Top 0.2: 110.29,29.81 TP2.TP
  Top 0.25: C16.2 arc90 136.29,18.36 136.29,22.11
  Top 0.406: IC1.4 v130.89,12.61 | IC4.4 v130.99,22.61 | v136.29,22.61 136.29,22.11 136.29,13.21 v135.99,12.61 135.99,7.81 137.36,6.44 SW1.2 | TP2.TP 112.19,29.41 112.59,29.01 | 112.59,29.01 D8.2 D7.2 D6.2 D5.2 D4.2 D3.2 D2.2 D1.2 | 112.59,29.01 112.98,28.9 112.99,29.41 113.59,30.01 113.75,30.17 C3.2 126.92,30.3 129.37,30.29 | 129.37,30.29 130.87,31.49 137.79,31.51 138.45,31.24 U3.1 139.88,31.21 142.29,31.21 142.29,24.71 140.19,22.61 | 140.19,22.61 v138.59,22.61 | R27.1 141.99,20.81 140.19,22.61 | 129.37,30.29 128.87,30.29 R34.1 | U2.8 100.58,24.7 101.19,25.31 105.56,25.31 C7.2 105.77,29.09 106.49,29.81 107.03,29.81 110.29,29.81
  Bottom 0.406: v130.89,12.61 v135.99,12.61 | v130.99,22.61 v136.29,22.61 v138.59,22.61
VEE  (via drill 0.35)
  Top 0.25: IC2.6 150.39,21.26 | v148.69,24.81 arc90 148.64,24.46 IC2.3
  Top 0.406: 146.79,32.61 128.34,32.61 128.54,32.41 128.69,32.26 R34.2 | 146.79,32.61 154.59,32.61 154.59,26.11 156.89,26.11 157.25,26.47 | 157.25,26.47 158.84,28.06 SW2.2 | 146.79,31.21 144.88,31.21 U3.8 146.88,31.24 D11.2 | 146.79,31.21 146.79,28.38 C10.1 148.27,27.42 | 146.79,31.21 146.79,32.61 | 154.59,21.26 L3.1 155.09,21.7 157.25,21.7 157.25,26.47 | 152.04,20.61 C15.1 151.98,20.35 v150.99,20.35 150.54,20.8 IC2.6
  Top 1.016: 154.59,21.26 154.19,20.91 153.84,20.66 C15.1
  Bottom 0.25: v150.99,20.35 arc-90 148.69,22.29 v148.69,24.81
(copper drawn outside any net)
  shapes: Top area x4

### Text on the board
tNames: Bat | Scap | REV - C / SEPT 2023 | SCAP+ | 25MM LOOP Antenna | SCAP- | H-Field sniffer | Gain | Gain | Thermorad | Low | High